# EAGLE schematic Controller_pump_v1.1 (EAGLE 7.2.0)
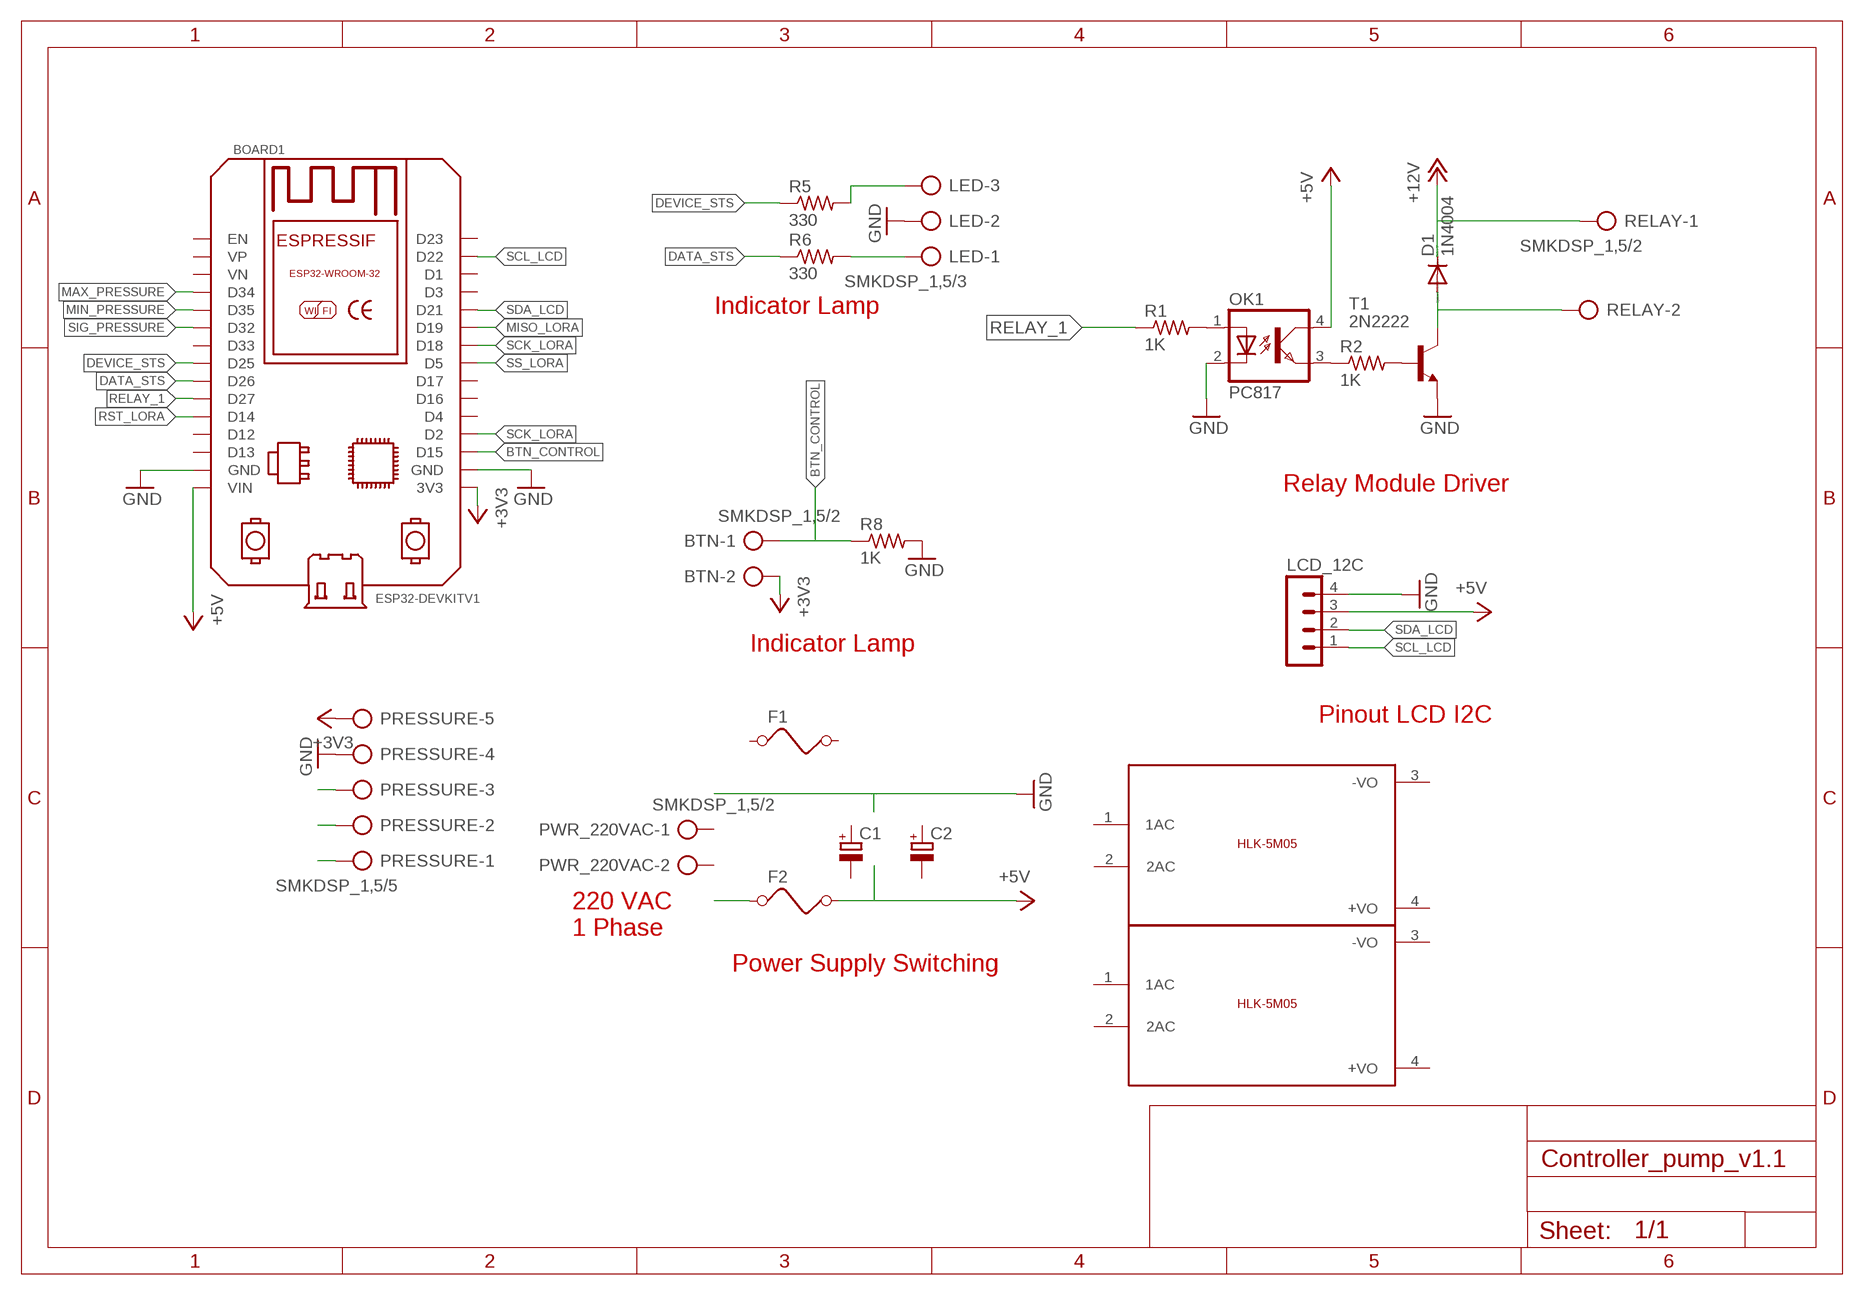
[diagram p0: schematic, sheet 1]

## Parts
BOARD1  ESP32DEVKITV1  [ESP32-DEVKITV1]
BTN  SMKDSP_1,5/2  [SMKDSP_1,5/2]
C1  CPOL-EUE5-5  [E5-5]
C2  CPOL-EUE5-5  [E5-5]
D1  1N4004  [DO41-10]
F1  FUSE  [FUSE]
F2  FUSE  [FUSE]
LCD_12C  MA04-1  [MA04-1]
LED  SMKDSP_1,5/3  [SMKDSP_1,5/3]
OK1  PC817  [DIL04]
PRESSURE  SMKDSP_1,5/5  [SMKDSP_1,5/5]
PWR_220VAC  SMKDSP_1,5/2  [SMKDSP_1,5/2]
R1  1K  R-US_0207/12  [0207/12]
R2  1K  R-US_0207/12  [0207/12]
R5  330  R-US_0207/12  [0207/12]
R6  330  R-US_0207/12  [0207/12]
R8  1K  R-US_0207/12  [0207/12]
RELAY  SMKDSP_1,5/2  [SMKDSP_1,5/2]
T1  2N2222  [TO18]
U$1  5VDC/5W  HLK-5M05  [HLK-5M05]
U$2  5VDC/5W  HLK-5M05  [HLK-5M05]

## Nets
+3V3: BOARD1.3V3 BTN.2 PRESSURE.5
+5V: BOARD1.VIN F2.2 LCD_12C.3 OK1.4(COL)
+12V: D1.C RELAY.1
BTN_CONTROL: BOARD1.D15 BTN.1 R8.1
DATA_STS: BOARD1.D26 R6.1
DEVICE_STS: BOARD1.D25 R5.1
GND: BOARD1.GND BOARD1.GND@1(GND) LCD_12C.4 LED.2 OK1.2(C) PRESSURE.4 R8.2 T1.1(E)
MAX_PRESSURE: BOARD1.D34 PRESSURE.1
MIN_PRESSURE: BOARD1.D35 PRESSURE.2
MISO_LORA: BOARD1.D19
N$3: D1.A RELAY.2 T1.3(C)
N$6: R2.2 T1.2(B)
N$7: LED.3 R5.2
N$8: LED.1 R6.2
N$9: OK1.3(EMIT) R2.1
N$10: OK1.1(A) R1.2
N$21: F2.1
RELAY_1: BOARD1.D27 R1.1
RST_LORA: BOARD1.D14
SCK_LORA: BOARD1.D2 BOARD1.D18
SCL_LCD: BOARD1.D22 LCD_12C.1
SDA_LCD: BOARD1.D21 LCD_12C.2
SIG_PRESSURE: BOARD1.D32 PRESSURE.3
SS_LORA: BOARD1.D5
Unconnected: BOARD1.D1 BOARD1.D3 BOARD1.D4 BOARD1.D12 BOARD1.D13 BOARD1.D16 BOARD1.D17 BOARD1.D23 BOARD1.D33 BOARD1.EN BOARD1.VN BOARD1.VP C1.+ C1.- C2.+ C2.- F1.1 F1.2 PWR_220VAC.1 PWR_220VAC.2 U$1.1(1AC) U$1.2(2AC) U$1.3(-VO) U$1.4(+VO) U$2.1(1AC) U$2.2(2AC) U$2.3(-VO) U$2.4(+VO)

## Notes on the sheet
- Indicator Lamp
- Relay Module Driver
- Indicator Lamp
- Pinout LCD I2C
- 220 VAC 
  1 Phase
- Power Supply Switching

## Library data of the parts
BOARD1 = ESP32-DEVKITV1:ESP32DEVKITV1: https://github.com/shridattdudhat
BTN PWR_220VAC RELAY = con-phoenix-smkdsp:SMKDSP_1,5/2: Printklemme, Nennstrom: 17,5 A, Bemessungsspannung: 250 V, Raster: 5,0 mm Source: http://eshop.phoenixcontact.de .. 1733415.pdf; MF: FARNELL; MPN: 1733570; OC_FARNELL: 3041244; OC_NEWARK: 69C8588
C1 C2 = resistor:CPOL-EU: POLARIZED CAPACITOR, European symbol
D1 = diode:1N4004: DIODE general purpose rectifier, 1 A
F1 F2 = special:FUSE: FUSE 5 x 20 mm
LCD_12C = con-lstb:MA04-1: PIN HEADER; OC_FARNELL: unknown; OC_NEWARK: unknown
LED = con-phoenix-smkdsp:SMKDSP_1,5/3: Printklemme, Nennstrom: 17,5 A, Bemessungsspannung: 250 V, Raster: 5,0 mm Source: http://eshop.phoenixcontact.de .. 1733415.pdf; MF: FARNELL; MPN: 1733583; OC_FARNELL: 3041256; OC_NEWARK: 71C4130
OK1 = optocoupler:PC817: SHARP OPTO COUPLER; MPN: PC817X4J000F; OC_FARNELL: 9707727; OC_NEWARK: 97K7059
PRESSURE = con-phoenix-smkdsp:SMKDSP_1,5/5: Printklemme, Nennstrom: 17,5 A, Bemessungsspannung: 250 V, Raster: 5,0 mm Source: http://eshop.phoenixcontact.de .. 1733415.pdf; OC_FARNELL: unknown; OC_NEWARK: unknown
R1 R2 R5 R6 R8 = resistor:R-US_: RESISTOR, American symbol
T1 = transistor:2N2222: NPN TRANSISTOR
U$1 U$2 = HLK-5M05:HLK-5M05: HLK-5M05 is an 5Volt/5W smps developed by HI-LINK; SIZE: 23x38(mm)